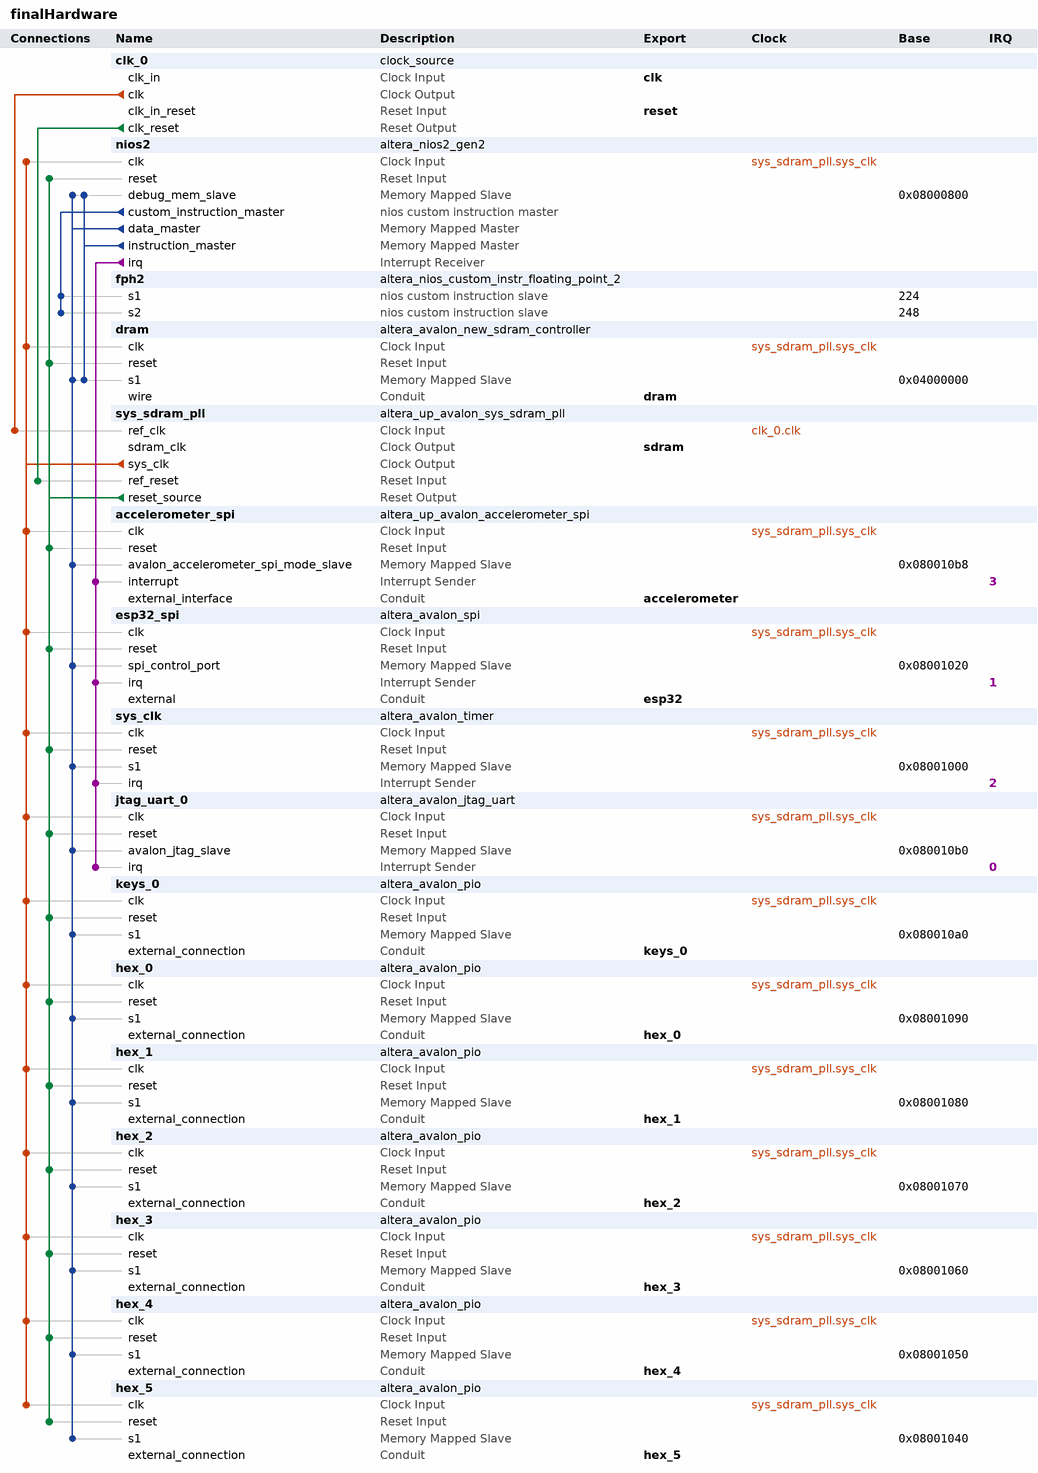
[diagram p0: system contents]
# Platform Designer (Qsys) system finalHardware, MAX 10 10M50DAF484C7G
# Parameters at their usual value, and those the tool derives, are not listed.
package require -exact qsys 20.1
create_system finalHardware
set_project_property DEVICE_FAMILY {MAX 10}
set_project_property DEVICE 10M50DAF484C7G

add_instance clk_0 clock_source 20.1
set_instance_parameter_value clk_0 clockFrequency 50000000

add_instance nios2 altera_nios2_gen2 20.1
set_instance_parameter_value nios2 dcache_size 2048
set_instance_parameter_value nios2 exceptionSlave dram.s1
set_instance_parameter_value nios2 icache_size 4096
set_instance_parameter_value nios2 impl Tiny
set_instance_parameter_value nios2 resetSlave dram.s1

add_instance fph2 altera_nios_custom_instr_floating_point_2 20.1
set_instance_parameter_value fph2 arithmetic_present true
set_instance_parameter_value fph2 comparison_present true
set_instance_parameter_value fph2 conversion_present true
set_instance_parameter_value fph2 root_present false

add_instance dram altera_avalon_new_sdram_controller 20.1
set_instance_parameter_value dram TAC 5.5
set_instance_parameter_value dram TRCD 20.0
set_instance_parameter_value dram TRP 20.0
set_instance_parameter_value dram casLatency 3
set_instance_parameter_value dram columnWidth 10
set_instance_parameter_value dram dataWidth 16
set_instance_parameter_value dram generateSimulationModel false
set_instance_parameter_value dram model single_Micron_MT48LC4M32B2_7_chip
set_instance_parameter_value dram numberOfBanks 4
set_instance_parameter_value dram numberOfChipSelects 1
set_instance_parameter_value dram powerUpDelay 100.0
set_instance_parameter_value dram refreshPeriod 15.625
set_instance_parameter_value dram rowWidth 13

add_instance sys_sdram_pll altera_up_avalon_sys_sdram_pll 18.0
set_instance_parameter_value sys_sdram_pll CV_boards DE10-Standard
set_instance_parameter_value sys_sdram_pll gui_outclk 50.0
set_instance_parameter_value sys_sdram_pll gui_refclk 50.0

add_instance accelerometer_spi altera_up_avalon_accelerometer_spi 18.0

add_instance esp32_spi altera_avalon_spi 20.1
set_instance_parameter_value esp32_spi clockPolarity 0
set_instance_parameter_value esp32_spi dataWidth 32
set_instance_parameter_value esp32_spi masterSPI true
set_instance_parameter_value esp32_spi numberOfSlaves 1
set_instance_parameter_value esp32_spi targetClockRate 40000000

add_instance sys_clk altera_avalon_timer 20.1
set_instance_parameter_value sys_clk period 1
set_instance_parameter_value sys_clk periodUnits MSEC

add_instance jtag_uart_0 altera_avalon_jtag_uart 20.1
set_instance_parameter_value jtag_uart_0 simInteractiveOptions NO_INTERACTIVE_WINDOWS

add_instance keys_0 altera_avalon_pio 20.1
set_instance_parameter_value keys_0 direction Input
set_instance_parameter_value keys_0 width 2

add_instance hex_0 altera_avalon_pio 20.1
set_instance_parameter_value hex_0 direction Output
set_instance_parameter_value hex_0 width 7

add_instance hex_1 altera_avalon_pio 20.1
set_instance_parameter_value hex_1 direction Output
set_instance_parameter_value hex_1 width 7

add_instance hex_2 altera_avalon_pio 20.1
set_instance_parameter_value hex_2 direction Output
set_instance_parameter_value hex_2 width 7

add_instance hex_3 altera_avalon_pio 20.1
set_instance_parameter_value hex_3 direction Output
set_instance_parameter_value hex_3 width 7

add_instance hex_4 altera_avalon_pio 20.1
set_instance_parameter_value hex_4 direction Output
set_instance_parameter_value hex_4 width 7

add_instance hex_5 altera_avalon_pio 20.1
set_instance_parameter_value hex_5 direction Output
set_instance_parameter_value hex_5 width 7

# connections
add_connection clk_0.clk sys_sdram_pll.ref_clk clock
add_connection sys_sdram_pll.sys_clk accelerometer_spi.clk clock
add_connection sys_sdram_pll.sys_clk dram.clk clock
add_connection sys_sdram_pll.sys_clk esp32_spi.clk clock
add_connection sys_sdram_pll.sys_clk hex_0.clk clock
add_connection sys_sdram_pll.sys_clk hex_1.clk clock
add_connection sys_sdram_pll.sys_clk hex_2.clk clock
add_connection sys_sdram_pll.sys_clk hex_3.clk clock
add_connection sys_sdram_pll.sys_clk hex_4.clk clock
add_connection sys_sdram_pll.sys_clk hex_5.clk clock
add_connection sys_sdram_pll.sys_clk jtag_uart_0.clk clock
add_connection sys_sdram_pll.sys_clk keys_0.clk clock
add_connection sys_sdram_pll.sys_clk nios2.clk clock
add_connection sys_sdram_pll.sys_clk sys_clk.clk clock
add_connection clk_0.clk_reset sys_sdram_pll.ref_reset reset
add_connection sys_sdram_pll.reset_source accelerometer_spi.reset reset
add_connection sys_sdram_pll.reset_source dram.reset reset
add_connection sys_sdram_pll.reset_source esp32_spi.reset reset
add_connection sys_sdram_pll.reset_source hex_0.reset reset
add_connection sys_sdram_pll.reset_source hex_1.reset reset
add_connection sys_sdram_pll.reset_source hex_2.reset reset
add_connection sys_sdram_pll.reset_source hex_3.reset reset
add_connection sys_sdram_pll.reset_source hex_4.reset reset
add_connection sys_sdram_pll.reset_source hex_5.reset reset
add_connection sys_sdram_pll.reset_source jtag_uart_0.reset reset
add_connection sys_sdram_pll.reset_source keys_0.reset reset
add_connection sys_sdram_pll.reset_source nios2.reset reset
add_connection sys_sdram_pll.reset_source sys_clk.reset reset
add_connection nios2.data_master accelerometer_spi.avalon_accelerometer_spi_mode_slave avalon
set_connection_parameter_value nios2.data_master/accelerometer_spi.avalon_accelerometer_spi_mode_slave baseAddress 0x080010b8
add_connection nios2.data_master dram.s1 avalon
set_connection_parameter_value nios2.data_master/dram.s1 baseAddress 0x04000000
add_connection nios2.data_master esp32_spi.spi_control_port avalon
set_connection_parameter_value nios2.data_master/esp32_spi.spi_control_port baseAddress 0x08001020
add_connection nios2.data_master hex_0.s1 avalon
set_connection_parameter_value nios2.data_master/hex_0.s1 baseAddress 0x08001090
add_connection nios2.data_master hex_1.s1 avalon
set_connection_parameter_value nios2.data_master/hex_1.s1 baseAddress 0x08001080
add_connection nios2.data_master hex_2.s1 avalon
set_connection_parameter_value nios2.data_master/hex_2.s1 baseAddress 0x08001070
add_connection nios2.data_master hex_3.s1 avalon
set_connection_parameter_value nios2.data_master/hex_3.s1 baseAddress 0x08001060
add_connection nios2.data_master hex_4.s1 avalon
set_connection_parameter_value nios2.data_master/hex_4.s1 baseAddress 0x08001050
add_connection nios2.data_master hex_5.s1 avalon
set_connection_parameter_value nios2.data_master/hex_5.s1 baseAddress 0x08001040
add_connection nios2.data_master jtag_uart_0.avalon_jtag_slave avalon
set_connection_parameter_value nios2.data_master/jtag_uart_0.avalon_jtag_slave baseAddress 0x080010b0
add_connection nios2.data_master keys_0.s1 avalon
set_connection_parameter_value nios2.data_master/keys_0.s1 baseAddress 0x080010a0
add_connection nios2.data_master nios2.debug_mem_slave avalon
set_connection_parameter_value nios2.data_master/nios2.debug_mem_slave baseAddress 0x08000800
add_connection nios2.data_master sys_clk.s1 avalon
set_connection_parameter_value nios2.data_master/sys_clk.s1 baseAddress 0x08001000
add_connection nios2.instruction_master dram.s1 avalon
set_connection_parameter_value nios2.instruction_master/dram.s1 baseAddress 0x04000000
add_connection nios2.instruction_master nios2.debug_mem_slave avalon
set_connection_parameter_value nios2.instruction_master/nios2.debug_mem_slave baseAddress 0x08000800
add_connection nios2.irq accelerometer_spi.interrupt interrupt
set_connection_parameter_value nios2.irq/accelerometer_spi.interrupt irqNumber 3
add_connection nios2.irq esp32_spi.irq interrupt
set_connection_parameter_value nios2.irq/esp32_spi.irq irqNumber 1
add_connection nios2.irq jtag_uart_0.irq interrupt
set_connection_parameter_value nios2.irq/jtag_uart_0.irq irqNumber 0
add_connection nios2.irq sys_clk.irq interrupt
set_connection_parameter_value nios2.irq/sys_clk.irq irqNumber 2
add_connection nios2.custom_instruction_master fph2.s1 nios_custom_instruction
set_connection_parameter_value nios2.custom_instruction_master/fph2.s1 CIName fph2
set_connection_parameter_value nios2.custom_instruction_master/fph2.s1 baseAddress 224
add_connection nios2.custom_instruction_master fph2.s2 nios_custom_instruction
set_connection_parameter_value nios2.custom_instruction_master/fph2.s2 CIName fph2_1
set_connection_parameter_value nios2.custom_instruction_master/fph2.s2 baseAddress 248

# exported interfaces
add_interface accelerometer conduit end
set_interface_property accelerometer EXPORT_OF accelerometer_spi.external_interface
add_interface clk clock sink
set_interface_property clk EXPORT_OF clk_0.clk_in
add_interface dram conduit end
set_interface_property dram EXPORT_OF dram.wire
add_interface esp32 conduit end
set_interface_property esp32 EXPORT_OF esp32_spi.external
add_interface hex_0 conduit end
set_interface_property hex_0 EXPORT_OF hex_0.external_connection
add_interface hex_1 conduit end
set_interface_property hex_1 EXPORT_OF hex_1.external_connection
add_interface hex_2 conduit end
set_interface_property hex_2 EXPORT_OF hex_2.external_connection
add_interface hex_3 conduit end
set_interface_property hex_3 EXPORT_OF hex_3.external_connection
add_interface hex_4 conduit end
set_interface_property hex_4 EXPORT_OF hex_4.external_connection
add_interface hex_5 conduit end
set_interface_property hex_5 EXPORT_OF hex_5.external_connection
add_interface keys_0 conduit end
set_interface_property keys_0 EXPORT_OF keys_0.external_connection
add_interface reset reset sink
set_interface_property reset EXPORT_OF clk_0.clk_in_reset
add_interface sdram clock source
set_interface_property sdram EXPORT_OF sys_sdram_pll.sdram_clk

set_interconnect_requirement {$system} qsys_mm.clockCrossingAdapter HANDSHAKE
set_interconnect_requirement {$system} qsys_mm.enableEccProtection FALSE
set_interconnect_requirement {$system} qsys_mm.insertDefaultSlave FALSE
set_interconnect_requirement {$system} qsys_mm.maxAdditionalLatency 1

save_system finalHardware.qsys
